# Altium schematic sheet Master MicroController Port F.SchDoc: Master Micro Controller Port F Pin Out
size A4; DocumentNumber: 21; SheetNumber: 21; SheetTotal: 54
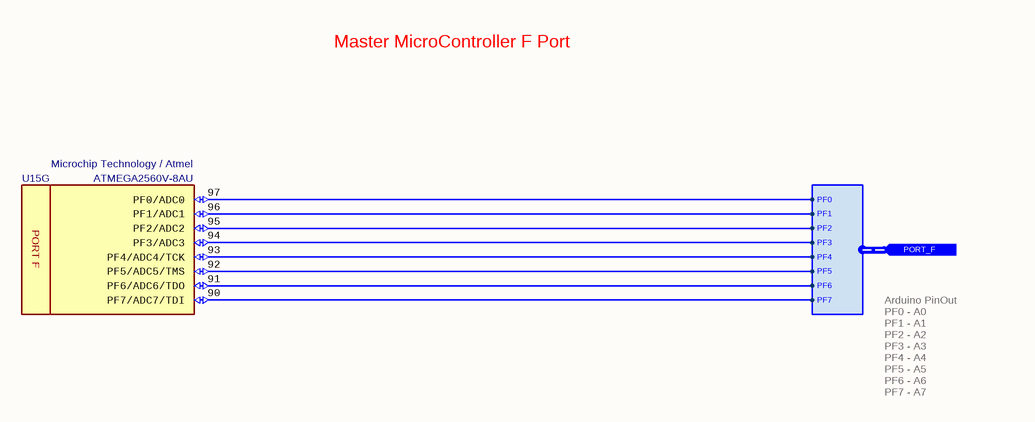
[diagram p0: Master MicroController Port F.SchDoc]

## Parts
U15  Manufacturer Part Number: ATMEGA2560V-8AU  Manufacturer Name: Microchip Technology / Atmel  [TQFP100]  (hidden comment: 8-bit MicroController)  (part G of 15)

## Ports
PORT_F (in, harness PORT_F)

## Harnesses
PORT_F: PF0, PF1, PF2, PF3, PF4, PF5, PF7, PF6

## Nets
NetU15_90: U15.90(PF7/ADC7/TDI) ; port PORT_F.PF7
NetU15_91: U15.91(PF6/ADC6/TDO) ; port PORT_F.PF6
NetU15_92: U15.92(PF5/ADC5/TMS) ; port PORT_F.PF5
NetU15_93: U15.93(PF4/ADC4/TCK) ; port PORT_F.PF4
NetU15_94: U15.94(PF3/ADC3) ; port PORT_F.PF3
NetU15_95: U15.95(PF2/ADC2) ; port PORT_F.PF2
NetU15_96: U15.96(PF1/ADC1) ; port PORT_F.PF1
NetU15_97: U15.97(PF0/ADC0) ; port PORT_F.PF0

## Notes on the sheet
- Master MicroController F Port
- Arduino PinOut
  PF0 - A0
  PF1 - A1
  PF2 - A2
  PF3 - A3
  PF4 - A4
  PF5 - A5
  PF6 - A6
  PF7 - A7
- Engineer
- All Rights are reserved to Customer and Engineer. [2021]
- Size:
- Date:
- A4
- Project :
- Time:
- Sheet
- of
- Customer
- Product ID
- Module ID
- Version
- File:
- Revision
- (in symbol IC - ATMEGA2560V-8AU, part G) PORT F

## Library data of the parts
U15 = IC - ATMEGA2560V-8AU: 8-bit Microcontrollers - MCU 256kB Flash 4kB EEPROM 86 I/O Pins; Supply Voltage - Min: 2V7; Supply Voltage - Max: 5.5V; Height: 1mm; ComponentLink1Description: DataSheet; ComponentLink1URL: https://eu.mouser.com/datasheet/2/268/Atmel-2549-8-bit-AVR-Microcontroller-ATmega640-128-1315286.pdf; ROHS: Yes; Minimum Operating Temperature: -40; Maximum Operating Temperature: +85; ComponentLink2Description: Mouser; ComponentLink2URL: https://eu.mouser.com/ProductDetail/Microchip-Technology-Atmel/ATMEGA2560V-8AU?qs=sGAEpiMZZMutXGli8Ay4kKlCYcvZUWqJYdtgGFyqFT8%3D; Supplier 1: Digi-Key; Supplier 2: Newark; Supplier 3: Avnet; Supplier 4: RSComponents; Supplier 5: RSComponents; Supplier Part Number 1: ATMEGA2560V-8AU-ND; Supplier Part Number 2: 68T2784; Supplier Part Number 3: 68T2784; Supplier Part Number 4: 1278284P; Supplier Part Number 5: 1278284; Case: TQFP-100; Supplier 6: Mouser; Supplier 7: Future Electronics; Supplier 8: Avnet; Supplier 9: Arrow Electronics; Supplier 10: Farnell; Supplier 11: Allied Electronics; Supplier 12: Future Electronics; Supplier 13: RSComponents; Supplier 14: RSComponents; Supplier 15: RSComponents; Supplier Part Number 6: 556-ATMEGA2560V8AU; Supplier Part Number 7: 4038198; Supplier Part Number 8: ATMEGA2560V-8AU; Supplier Part Number 9: ATMEGA2560V-8AU; Supplier Part Number 10: 1288331; Supplier Part Number 11: 70124009; Supplier Part Number 12: ATMEGA2560V-8AU-TRAY; Supplier Part Number 13: 6963424; Supplier Part Number 14: 6963424P; Supplier Part Number 15: 9220809